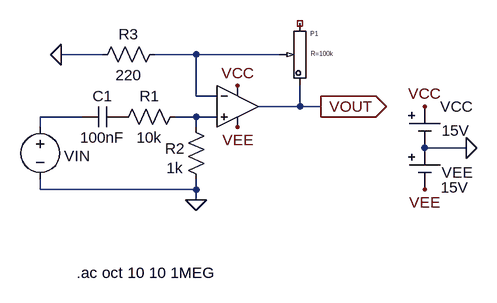
[diagram p0: schematic OpAmpNonInvertente.asc]
OpAmpNonInvertente.asc, the LTspice schematic file:
Version 4
SHEET 1 880 680
WIRE 192 272 128 272
WIRE 336 272 272 272
WIRE 464 272 336 272
WIRE 336 336 336 272
WIRE 368 336 336 336
WIRE 496 352 496 320
WIRE 496 352 432 352
WIRE 528 352 496 352
WIRE 160 368 96 368
WIRE 336 368 304 368
WIRE 368 368 336 368
WIRE 96 384 96 368
WIRE 336 384 336 368
WIRE 752 416 688 416
WIRE 96 480 96 464
WIRE 336 480 336 464
WIRE 336 480 96 480
WIRE 336 496 336 480
FLAG 336 496 0
FLAG 128 272 0
FLAG 528 352 VOUT
IOPIN 528 352 Out
FLAG 400 320 VCC
FLAG 400 384 VEE
FLAG 688 352 VCC
FLAG 688 480 VEE
FLAG 752 416 0
SYMBOL Opamps/UniversalOpamp2 400 352 R0
WINDOW 0 16 -32 Invisible 2
SYMATTR InstName U1
SYMBOL cap 224 352 R90
WINDOW 0 0 32 VBottom 2
WINDOW 3 32 32 VTop 2
SYMATTR InstName C1
SYMATTR Value 100nF
SYMBOL res 320 352 R90
WINDOW 0 0 56 VBottom 2
WINDOW 3 32 56 VTop 2
SYMATTR InstName R1
SYMATTR Value 10k
SYMBOL res 352 480 R180
WINDOW 0 33 63 Left 2
WINDOW 3 36 33 Left 2
SYMATTR InstName R2
SYMATTR Value 1k
SYMBOL res 176 288 R270
WINDOW 0 32 56 VTop 2
WINDOW 3 0 56 VBottom 2
SYMATTR InstName R3
SYMATTR Value 220
SYMBOL pot 496 272 R0
WINDOW 123 16 26 Invisible 2
SYMATTR InstName P1
SYMATTR Value R=100k
SYMBOL voltage 96 368 R0
WINDOW 0 37 60 Left 2
WINDOW 3 24 96 Invisible 2
SYMATTR InstName VIN
SYMATTR Value SINE(0 1 1k)
SYMATTR Value2 AC 1
SYMBOL Misc/cell 688 352 R0
WINDOW 3 26 37 Left 2
SYMATTR Value 15V
SYMATTR InstName VCC
SYMBOL Misc/cell 688 416 R0
WINDOW 0 26 38 Left 2
WINDOW 3 25 61 Left 2
SYMATTR InstName VEE
SYMATTR Value 15V
TEXT 152 608 Left 2 !.ac oct 10 10 1MEG

The netlist it stands for:
* OpAmpNonInvertente.asc
XU1 N003 N001 VCC VEE VOUT level.2 Avol=1Meg GBW=10Meg Slew=10Meg ilimit=25m rail=0 Vos=0 phimargin=45 en=0 enk=0 in=0 ink=0 Rin=500Meg  ; pins IN+ IN- V+ V- OUT
C1 P001 N002 100nF
R1 N003 P001 10k
R2 0 N003 1k
R3 0 N001 220
XP1 NC_01 VOUT N001 pot R=100k T=.5  ; pins A B C
VIN N002 0 SINE(0 1 1k) AC 1
VCC VCC 0 15V
VEE 0 VEE 15V
.ac oct 10 10 1MEG
.lib UniversalOpamps2.sub
.lib .\pot.lib
.backanno
.end